# Altium schematic sheet SPI Bus.SchDoc
size 149 x 100 mm
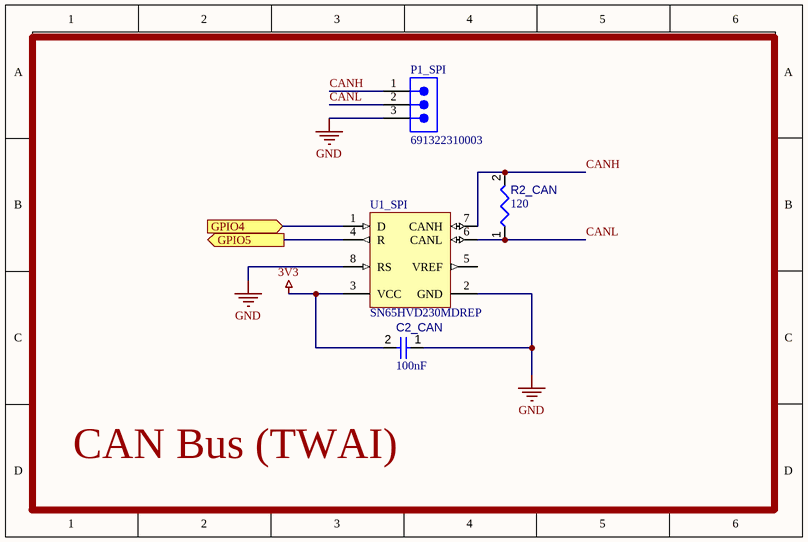
[diagram p0: SPI Bus.SchDoc]

## Parts
C2_CAN  value 100nF  [CAPC0402(1005)60_L]  (hidden comment: Capacitor 100nF +/-20% 50V 0402)
P1_SPI  691322310003  [691322310003]
R2_CAN  value 120  [RESC0603(1608)_L]  (hidden comment: Resistor 120R +/-5 % 0603 0.1 W)
U1_SPI  SN65HVD230MDREP  [D0008A_L]

## Ports
GPIO4 (in), GPIO5 (out)

## Nets
3V3: C2_CAN.2 U1_SPI.3(VCC)
GND: C2_CAN.1 P1_SPI.3 U1_SPI.2(GND) U1_SPI.8(RS)
CANH: P1_SPI.1 R2_CAN.2 U1_SPI.7(CANH)
CANL: P1_SPI.2 R2_CAN.1 U1_SPI.6(CANL)
GPIO4: U1_SPI.1(D) ; port GPIO4
GPIO5: U1_SPI.4(R) ; port GPIO5

Not connected (* = marked no-connect by the designer): U1_SPI 5(VREF)

## Notes on the sheet
- CAN Bus (TWAI)

## Library data of the parts
C2_CAN = CMP-001-00067-3: Chip Capacitor, 100nF +/-20%, 50V, 0402, Thickness 0.6 mm; Tolerance: 10%; Min Operating Temperature: -55°C; Pins: 2; Case/Package: 0402; Max Operating Temperature: 85°C; Voltage Rating: 50V; Mounting Technology: SMT
P1_SPI = CMP-1502-01887-3: 322; 3.81mm Pitch Straight Pluggable Term Block; PCB Header; Through Hole; 3 Way; Voltage: 300V; Current: 10A; Gender: Male; Number of Contacts: 3; Number of Levels: 1; Lead Pitch: 3.81mm; Termination: Solder; Packaging: Box; Length: 10.5mm; Contact Plating: Tin; RoHS: Compliant; Number of Rows: 1; Contact Material: Tin; Height: 7.2mm; Color: Green; Number of Pins: 3; Max Operating Temperature: 105°C; Current Rating: 10A; Voltage Rating: 300V; Min Operating Temperature: -40°C; Pitch: 3.81mm; Mount: Through Hole; Number of Positions Per Level: 3; Width: 12.82mm
R2_CAN = CMP-009-00176-3: Chip Resistor, 120 Ohms, +/-5 %, 0.1 W, -55 to 155 degC, 0603; Power: 100mW; Tolerance: 5%; Max Operating Temperature: 155°C; Pins: 2; Case/Package: 0603; Min Operating Temperature: -55°C
U1_SPI = CMP-0315-00052-2: Enhanced Product 3.3 V Can Transceiver with Standby Mode, 17 mA, -55 to 125 degC, 8-pin SOIC (D), Green (RoHS & no Sb/Br); Manufacturer: Texas Instruments; Supply Voltage(s)(V): 3.3; ICC(Max)(mA): 17; Receivers Per Package: 1; Transient Pulse Protection(V): -25 to 25; Rating: HiRel Enhanced Product; DatasheetVersion: SGLS356; Isolated: No; PackageDescription: 8-Pin Plastic Small Outline Integrated Circuit, 4.9 x 3.9 mm, Pitch 1.27 mm Pitch; Mounting Technology: Surface Mount; ComponentLink1Description: Datasheet; Low Power Mode: Standby; PackageVersion: revM, Jun-2011; SubFamily: CAN; ComponentLink1URL: http://www.ti.com/general/docs/lit/getliterature.tsp?genericPartNumber=SN65HVD230M-EP&fileType=pdf; Code_JEDEC: MS-012AA; Drivers Per Package: 1; Footprint: PCA82C250; PackageReference: D0008A; PartNumber: SN65HVD230MDREP; Eco-Plan: Green (RoHS & no Sb/Br)